# Altium schematic sheet Sensing.SchDoc
size A4; SheetNumber: 6; SheetTotal: 7
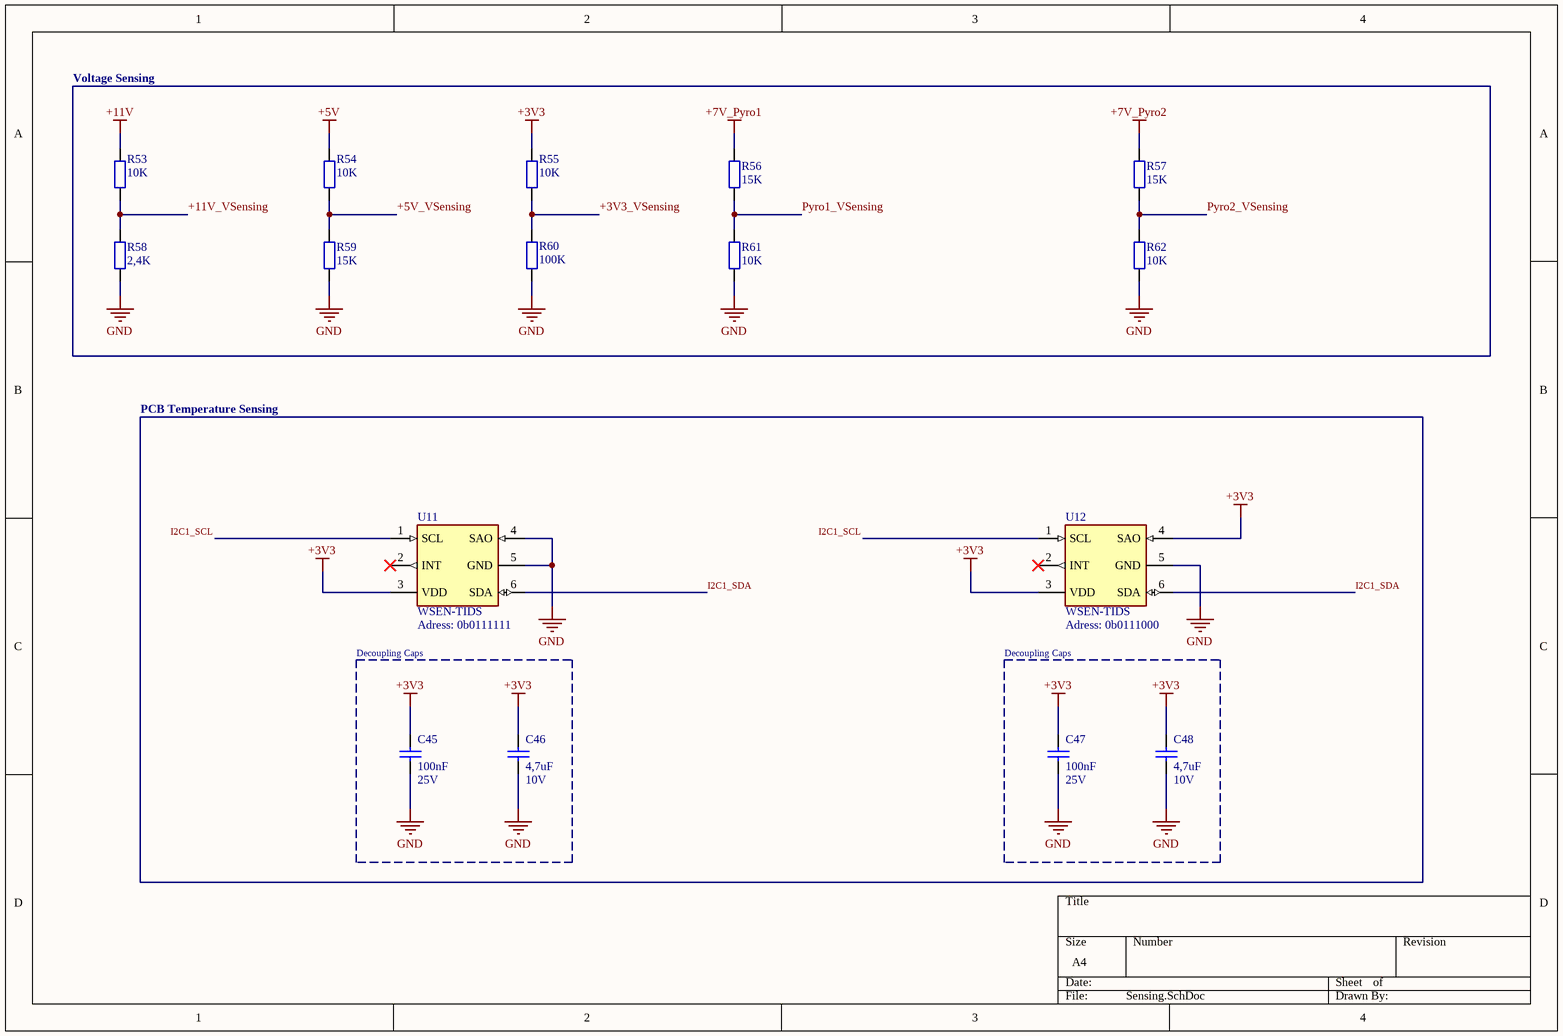
[diagram p0: Sensing.SchDoc]

## Parts
C45  value 100nF  Voltage: 25V  [MY_0603]  (hidden comment: Cap ceramic)
C46  value 4,7uF  Volte: 10V  [MY_0603]  (hidden comment: Cap ceramic)
C47  value 100nF  Voltage: 25V  [MY_0603]  (hidden comment: Cap ceramic)
C48  value 4,7uF  Volte: 10V  [MY_0603]  (hidden comment: Cap ceramic)
R53  10K  [R0603-0.45]
R54  10K  [R0603-0.45]
R55  10K  [R0603-0.45]
R56  15K  [R0603-0.45]
R57  15K  [R0603-0.45]
R58  2,4K  [R0603-0.45]
R59  15K  [R0603-0.45]
R60  100K  [R0603-0.45]
R61  10K  [R0603-0.45]
R62  10K  [R0603-0.45]
U11  WSEN-TIDS  [WSEN-TIDS-Footprint-1]
U12  WSEN-TIDS  [WSEN-TIDS-Footprint-1]

## Blocks framed on the sheet
Voltage Sensing: R53-R62
Decoupling Caps: C45 C46
Decoupling Caps: C47 C48

## Nets
+3V3: C45.2 C46.2 C47.2 C48.2 R55.1 U11.3(VDD) U12.3(VDD) U12.4(SAO)
+5V: R54.1
+7V_Pyro1: R56.2
+7V_Pyro2: R57.2
+11V: R53.1
GND: C45.1 C46.1 C47.1 C48.1 R58.1 R59.1 R60.2 R61.2 R62.2 U11.4(SAO) U11.5(GND) U12.5(GND)
+3V3_VSensing: R55.2 R60.1
+5V_VSensing: R54.2 R59.2
+11V_VSensing: R53.2 R58.2
I2C1_SCL: U11.1(SCL) U12.1(SCL)
I2C1_SDA: U11.6(SDA) U12.6(SDA)
Pyro1_VSensing: R56.1 R61.1
Pyro2_VSensing: R57.1 R62.1

Not connected (* = marked no-connect by the designer): U11 2(INT)*; U12 2(INT)*

## Notes on the sheet
- PCB Temperature Sensing
- (near U11) Adress: 0b0111111
- (near U12) Adress: 0b0111000

## Library data of the parts
C45 C47 = CMP-015-000000-1: Capacitor, 100nF, 0603, 25V; Manufacturer: Wurth Elektronik; Manufacturer Part Number: 885012206071
C46 C48 = CMP-015-000000-1: Capacitor, 4.7uF, 0603, 10V; ASiD Part Number: C-AS; Manufacturer: Wurth Elektronik; Manufacturer Part Number: 885012106012; Source: PCB_Project1.SCHLIB; Pin Count: 2; Design Item ID: Cap ceramic; Component Type: Standard
R53-R55 R61 R62 = R: Resistor, 10K, 0603, 0.1W; Manufacturer: Wurth; Manufacturer Part Number: 560112116005; Power Disipation: 0.1W; ClassName: 2PyroREG
R56 R57 R59 = CMP-009-000000-3: Resistor, 15K, 0603, 0.1W; Manufacturer: Wurth; Manufacturer Part Number: 560112116035; Power Disipation: 0.1
R58 = CMP-009-000000-3: Resistor, 2.4K, 0603, 0.1W; Manufacturer: Wurth; Manufacturer Part Number: 560112116061; Power Disipation: 0.1W
R60 = R: Resistor, 100K, 0603, 0.1W; Manufacturer: Wurth; Manufacturer Part Number: 560112116004; Power Disipation: 0.1W; ClassName: REG5V
U11 U12 = CMP-010-00003-1: Analog Resistance Temperature Sensor; Manufacturer: Wurth Elektronik; Manufacturer Part Number: WSEN-TIDS